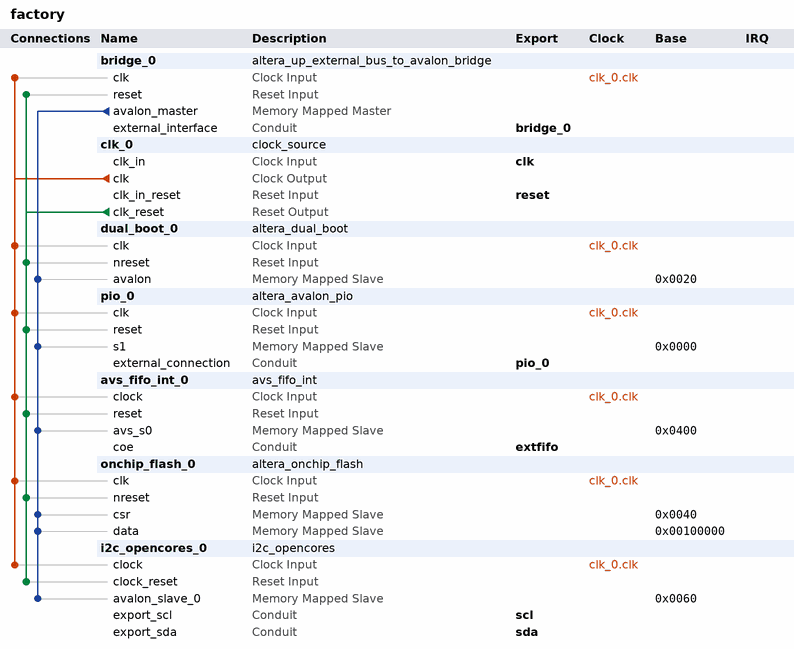
[diagram p0: system contents]
# Platform Designer (Qsys) system factory, MAX 10 10M16SAU169I7G
# Parameters at their usual value, and those the tool derives, are not listed.
package require -exact qsys 18.1
create_system factory
set_project_property DEVICE_FAMILY {MAX 10}
set_project_property DEVICE 10M16SAU169I7G

add_instance bridge_0 altera_up_external_bus_to_avalon_bridge 18.0
set_instance_parameter_value bridge_0 addr_size 2
set_instance_parameter_value bridge_0 addr_size_multiplier Mbytes
set_instance_parameter_value bridge_0 data_size 32

add_instance clk_0 clock_source 18.1
set_instance_parameter_value clk_0 clockFrequency 40000000

add_instance dual_boot_0 altera_dual_boot 18.1
set_instance_parameter_value dual_boot_0 CLOCK_FREQUENCY 40.0

add_instance pio_0 altera_avalon_pio 18.1
set_instance_parameter_value pio_0 bitModifyingOutReg true
set_instance_parameter_value pio_0 direction Output
set_instance_parameter_value pio_0 width 8

add_instance avs_fifo_int_0 avs_fifo_int 1.0

add_instance onchip_flash_0 altera_onchip_flash 18.1
set_instance_parameter_value onchip_flash_0 CLOCK_FREQUENCY 40.0
set_instance_parameter_value onchip_flash_0 CONFIGURATION_MODE {Dual Compressed Images}
set_instance_parameter_value onchip_flash_0 SECTOR_ACCESS_MODE {Read and write,Read and write,Read and write,Read and write,Read and write}
set_instance_parameter_value onchip_flash_0 initFlashContent false
set_instance_parameter_value onchip_flash_0 initializationFileName altera_onchip_flash.hex
set_instance_parameter_value onchip_flash_0 useNonDefaultInitFile false

add_instance i2c_opencores_0 i2c_opencores 13.0

# connections
add_connection clk_0.clk avs_fifo_int_0.clock clock
add_connection clk_0.clk bridge_0.clk clock
add_connection clk_0.clk dual_boot_0.clk clock
add_connection clk_0.clk i2c_opencores_0.clock clock
add_connection clk_0.clk onchip_flash_0.clk clock
add_connection clk_0.clk pio_0.clk clock
add_connection clk_0.clk_reset avs_fifo_int_0.reset reset
add_connection clk_0.clk_reset bridge_0.reset reset
add_connection clk_0.clk_reset dual_boot_0.nreset reset
add_connection clk_0.clk_reset i2c_opencores_0.clock_reset reset
add_connection clk_0.clk_reset onchip_flash_0.nreset reset
add_connection clk_0.clk_reset pio_0.reset reset
add_connection bridge_0.avalon_master avs_fifo_int_0.avs_s0 avalon
set_connection_parameter_value bridge_0.avalon_master/avs_fifo_int_0.avs_s0 baseAddress 0x0400
add_connection bridge_0.avalon_master dual_boot_0.avalon avalon
set_connection_parameter_value bridge_0.avalon_master/dual_boot_0.avalon baseAddress 0x0020
add_connection bridge_0.avalon_master i2c_opencores_0.avalon_slave_0 avalon
set_connection_parameter_value bridge_0.avalon_master/i2c_opencores_0.avalon_slave_0 baseAddress 0x0060
add_connection bridge_0.avalon_master onchip_flash_0.csr avalon
set_connection_parameter_value bridge_0.avalon_master/onchip_flash_0.csr baseAddress 0x0040
add_connection bridge_0.avalon_master onchip_flash_0.data avalon
set_connection_parameter_value bridge_0.avalon_master/onchip_flash_0.data baseAddress 0x00100000
add_connection bridge_0.avalon_master pio_0.s1 avalon
set_connection_parameter_value bridge_0.avalon_master/pio_0.s1 baseAddress 0x0000

# exported interfaces
add_interface bridge_0 conduit end
set_interface_property bridge_0 EXPORT_OF bridge_0.external_interface
add_interface clk clock sink
set_interface_property clk EXPORT_OF clk_0.clk_in
add_interface extfifo conduit end
set_interface_property extfifo EXPORT_OF avs_fifo_int_0.coe
add_interface pio_0 conduit end
set_interface_property pio_0 EXPORT_OF pio_0.external_connection
add_interface reset reset sink
set_interface_property reset EXPORT_OF clk_0.clk_in_reset
add_interface scl conduit end
set_interface_property scl EXPORT_OF i2c_opencores_0.export_scl
add_interface sda conduit end
set_interface_property sda EXPORT_OF i2c_opencores_0.export_sda

set_interconnect_requirement {$system} qsys_mm.clockCrossingAdapter HANDSHAKE
set_interconnect_requirement {$system} qsys_mm.enableEccProtection FALSE
set_interconnect_requirement {$system} qsys_mm.insertDefaultSlave FALSE
set_interconnect_requirement {$system} qsys_mm.maxAdditionalLatency 1

save_system factory.qsys
